# EAGLE design Carte USB (EAGLE 7.2.0)
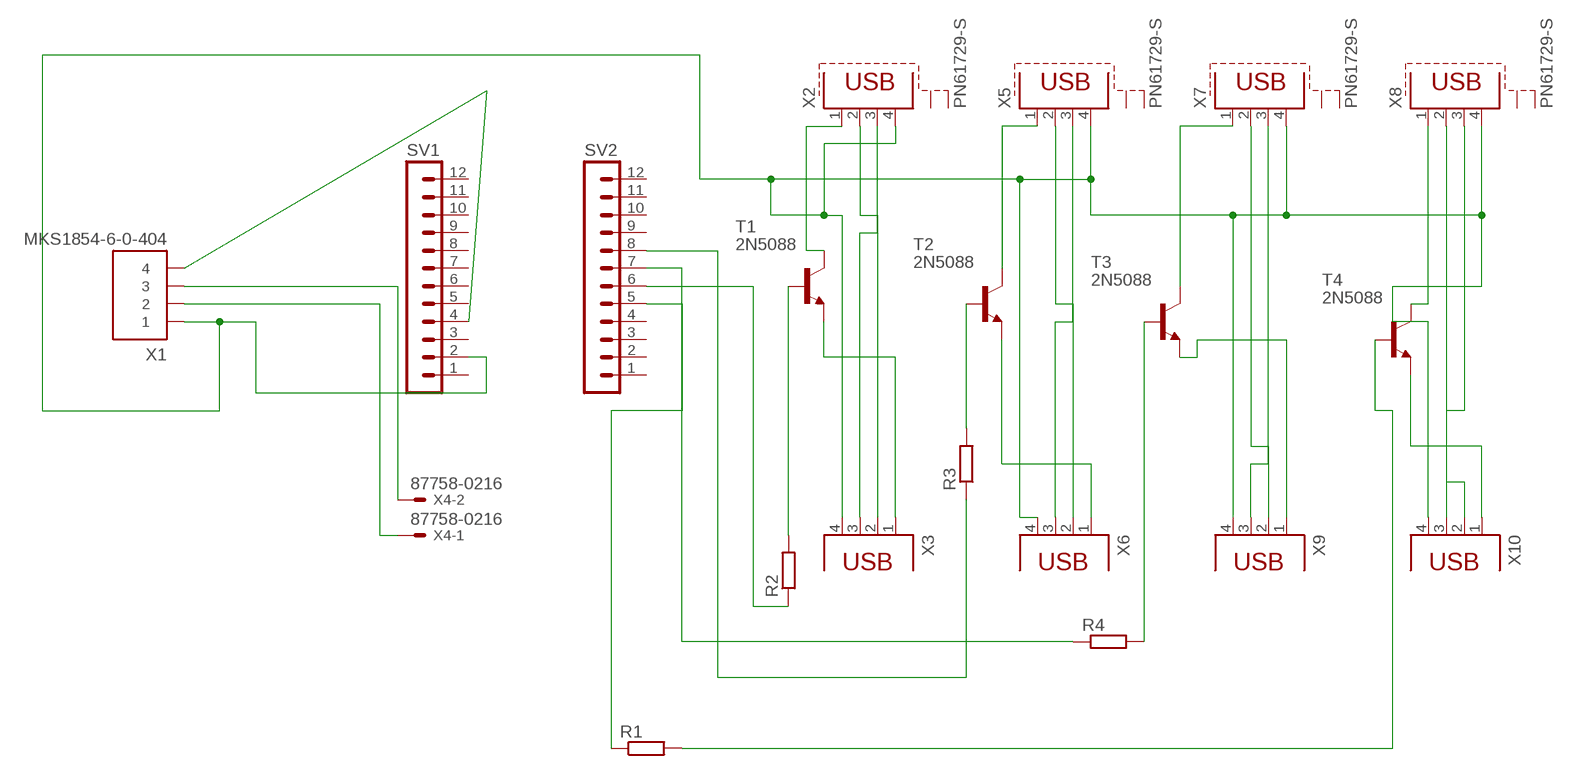
[diagram p0: schematic, sheet 1]

## Parts
R1  R-EU_0207/10  [0207/10]
R2  R-EU_0207/10  [0207/10]
R3  R-EU_0207/10  [0207/10]
R4  R-EU_0207/10  [0207/10]
SV1  MA12-1  [MA12-1]
SV2  MA12-1  [MA12-1]
T1  2N5088  [TO92]
T2  2N5088  [TO92]
T3  2N5088  [TO92]
T4  2N5088  [TO92]
X1  MKS1854-6-0-404  [MKS1854-6-0-404]
X2  PN61729-S  [PN61729-S]
X3  PN87520  [PN87520]
X4  87758-0216  [87758-0216]
X5  PN61729-S  [PN61729-S]
X6  PN87520  [PN87520]
X7  PN61729-S  [PN61729-S]
X8  PN61729-S  [PN61729-S]
X9  PN87520  [PN87520]
X10  PN87520  [PN87520]

## Nets
N$1: X1.3 X4.2
N$2: X1.2 X4.1
N$3: T1.1(C) X2.1
N$4: X2.2 X3.2
N$5: SV1.4 X1.4
N$6: T2.1(C) X5.1
N$7: X2.3 X3.3
N$8: X5.3 X6.3
N$9: T2.3(E) X6.1
N$10: X5.2 X6.2
N$11: T3.1(C) X7.1
N$12: X7.2 X9.2
N$14: X7.3 X9.3
N$15: T4.1(C) X8.1
N$16: X8.2 X10.2
N$17: X8.3 X10.3
N$18: SV1.2 X1.1 X2.4 X3.4 X5.4 X6.4 X7.4 X8.4 X9.4 X10.4
N$20: T3.3(E) X9.1
N$21: T4.3(E) X10.1
N$25: T1.3(E) X3.1
N$26: R3.2 T2.2(B)
N$27: R4.2 T3.2(B)
N$28: R2.2 T1.2(B)
N$29: R1.2 T4.2(B)
N$30: R1.1 SV2.5
N$31: R2.1 SV2.6
N$32: R4.1 SV2.7
N$33: R3.1 SV2.8
Unconnected: SV1.1 SV1.3 SV1.5 SV1.6 SV1.7 SV1.8 SV1.9 SV1.10 SV1.11 SV1.12 SV2.1 SV2.2 SV2.3 SV2.4 SV2.9 SV2.10 SV2.11 SV2.12 X2.S1 X2.S2 X5.S1 X5.S2 X7.S1 X7.S2 X8.S1 X8.S2

## Library data of the parts
R1-R4 = rcl:R-EU_: RESISTOR, European symbol
SV1 SV2 = con-lstb:MA12-1: PIN HEADER; OC_FARNELL: unknown; OC_NEWARK: unknown
T1-T4 = transistor:2N5088: NPN TRANSISTOR
X1 = con-stocko:MKS1854-6-0-404: Serie MKS 1850 Lötstifte In-line, Raster 2.5 mm, Stiftwannen, stehend, mit Rastlasche Source: http://www.stocko.de/de/index.php?seite=ka_rfk2_mks1850.html&rubrik=Katalog+-+RFK+2 rfk_1850.pdf; OC_FARNELL: 1141862; OC_NEWARK: unknown
X2 X5 X7 X8 = con-berg:PN61729-S: BERG USB connector; OC_FARNELL: unknown; OC_NEWARK: unknown
X3 X6 X9 X10 = con-berg:PN87520: BERG USB connector; OC_FARNELL: unknown; OC_NEWARK: unknown
X4 = con-molex:87758-0216: 2 Pin - 2mm Dual Row Single Wafer, Vertical T/H HDR Source: http://www.molex.com/pdm_docs/sd/877580616_sd.pdf; MPN: 87758-0216; OC_FARNELL: unknown; OC_NEWARK: 94M1513

## Net classes
0 default: width 0.75 mm

## Board
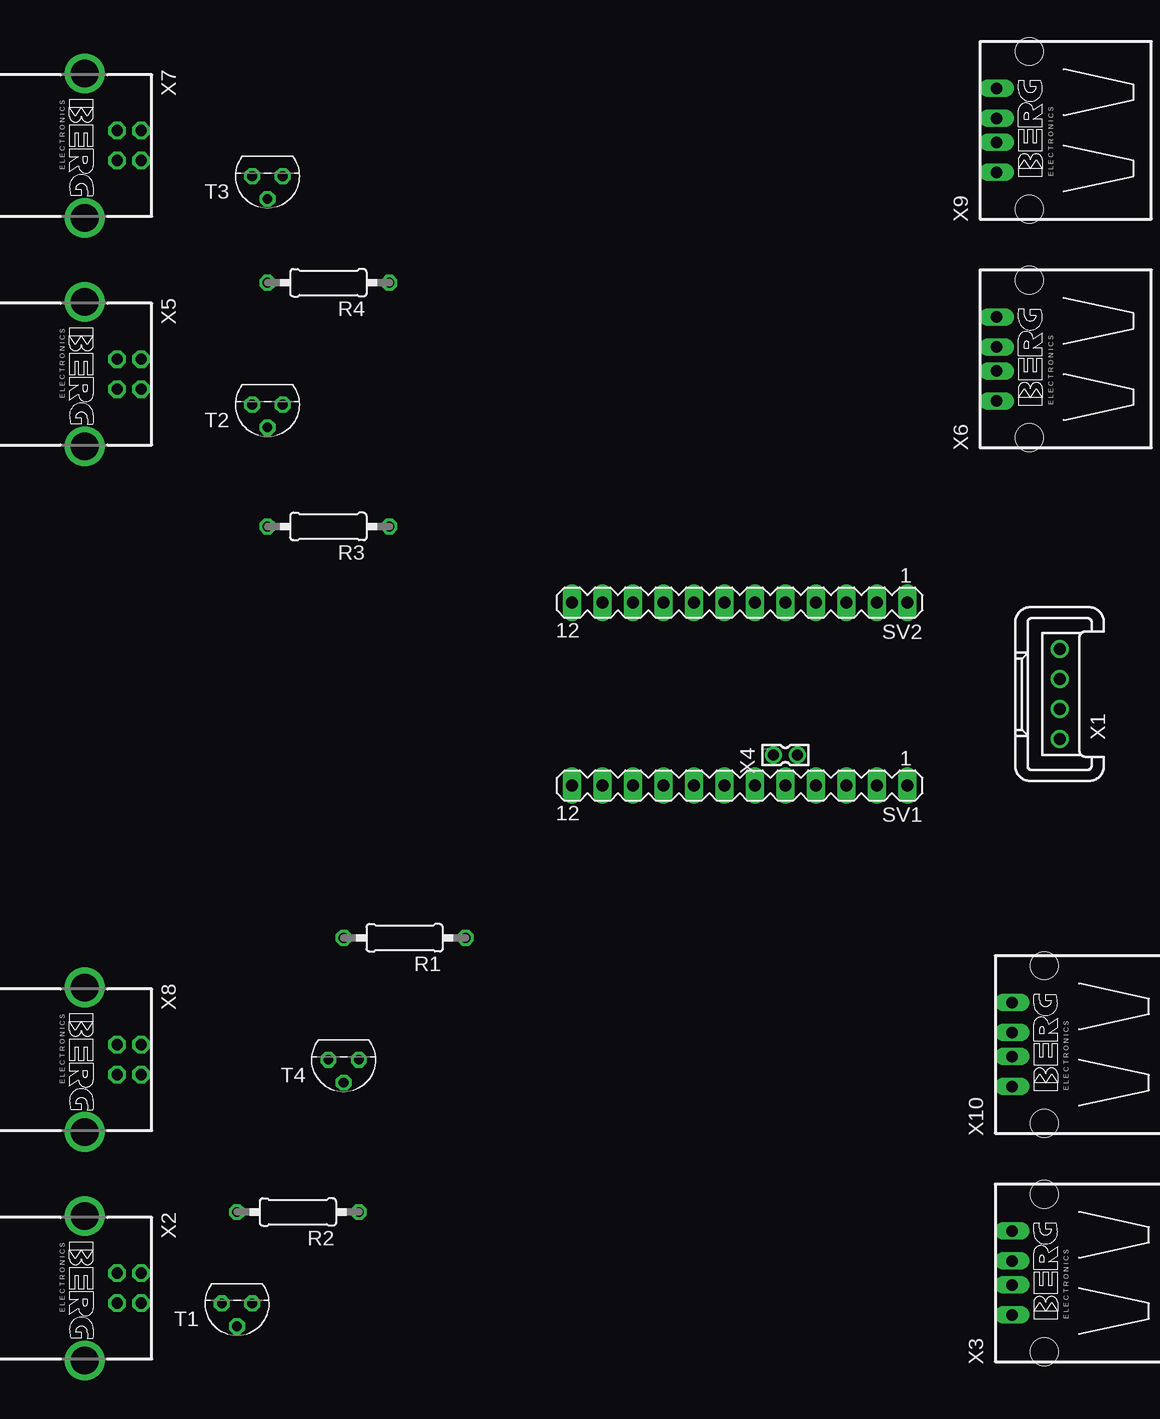
[diagram p1: board, top side]
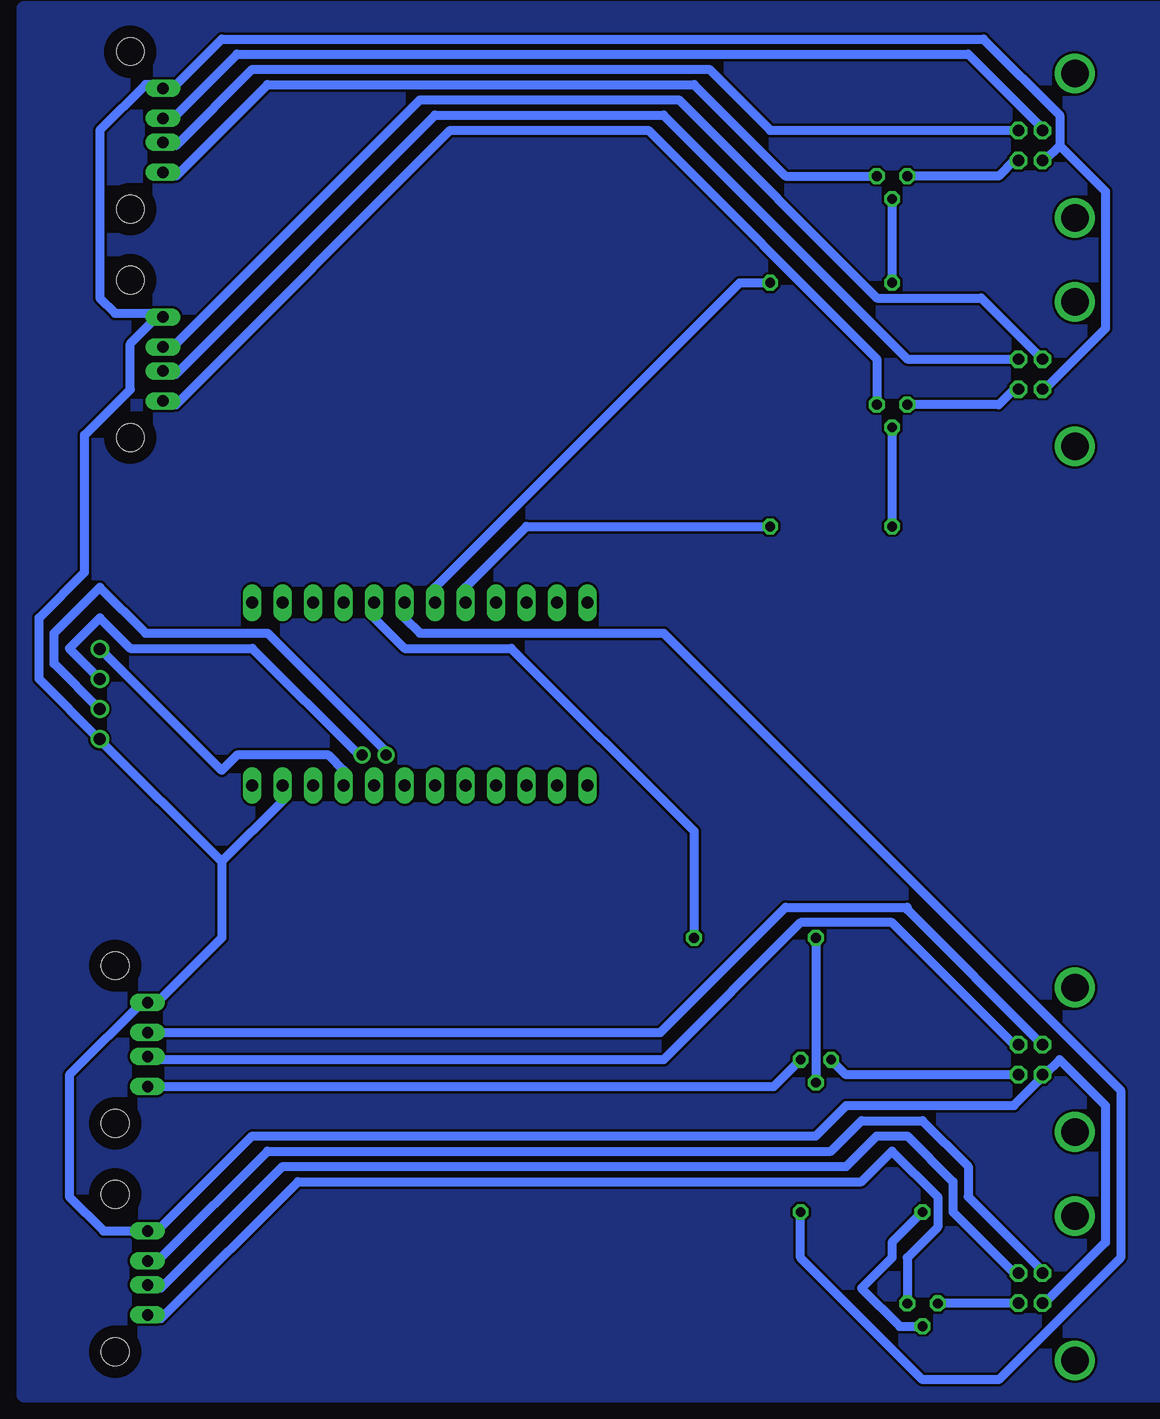
[diagram p2: board, bottom side, seen from below]

No outline drawn. Coordinates in mm, seen from the top.
Copper layers (1*16): Top 0.035mm / dielectric 1.5mm / Bottom 0.035mm
Design rules "default": minimum track width 10mil, minimum drill 24mil, track to track 8mil, track to pad 8mil, pad to pad 8mil, via to via 8mil, smd to smd 8mil, copper to edge 40mil, drill to drill 8mil, minimum pad ring 10mil, minimum via ring 8mil, stop-mask expansion 4mil, vias tented up to drill 0mil, thermal gap 10mil

### Footprints (pad centres in the part's own frame; a part is rotated, then mirrored left to right if it is on the bottom)
0207/10 = drill 0.813 octagon: 1 -5.08,0; 2 5.08,0
MA12-1 = drill 1.016 long: 1 -13.97,0; 2 -11.43,0; 3 -8.89,0; 4 -6.35,0; 5 -3.81,0; 6 -1.27,0; 7 1.27,0; 8 3.81,0; 9 6.35,0; 10 8.89,0; 11 11.43,0; 12 13.97,0
TO92 = drill 0.813 octagon: 1 1.27,0; 2 0,1.905; 3 -1.27,0
MKS1854-6-0-404 = drill 1 pad 1.422: 1 -3.75,0; 2 -1.25,0; 3 1.25,0; 4 3.75,0
PN61729-S = drill 0.95 octagon: 1 1.25,4.71; 2 -1.25,4.71; 3 -1.25,2.71; 4 1.25,2.71 | drill 2.3 pad 2.9: S1 -6.02,0; S2 6.02,0
PN87520 = drill 0.95 long: 1 -3.5,2.71; 2 -1,2.71; 3 1,2.71; 4 3.5,2.71 | hole 2.3: -6.57,0; 6.57,0
87758-0216 = drill 0.9 pad 1.27: 1 0,-1; 2 0,1

### Placement (x,y rotation side)
R1  125.73,35.56 180 top
R2  116.84,12.7 180 top
R3  119.38,69.85 180 top
R4  119.38,90.17 180 top
SV1  153.67,48.26 180 top
SV2  153.67,63.5 180 top
T1  111.76,5.08 180 top
T2  114.3,80.01 180 top
T3  114.3,99.06 180 top
T4  120.65,25.4 180 top
X1  180.34,55.88 90 top
X2  99.06,6.35 270 top
X3  179.07,7.62 90 top
X4  157.48,50.8 270 top
X5  99.06,82.55 270 top
X6  177.8,83.82 90 top
X7  99.06,101.6 270 top
X8  99.06,25.4 270 top
X9  177.8,102.87 90 top
X10  179.07,26.67 90 top

### Tracks (layer width: path | path; a pad name or v marks a point on that pad's centre or on a via)
N$1
  Bottom 0.75: X4.2 158.75,50.8 167.64,59.69 177.8,59.69 180.34,62.23 182.88,59.69 180.34,57.15 X1.3
N$2
  Bottom 0.75: X4.1 156.21,50.8 166.37,60.96 176.53,60.96 180.34,64.77 184.15,60.96 184.15,58.42 180.34,54.61 X1.2
N$3
  Bottom 0.75: T1.1 104.14,5.08 X2.1
N$4
  Bottom 0.75: X2.2 104.14,7.62 109.22,12.7 109.22,15.24 113.03,19.05 115.57,19.05 118.11,16.51 165.1,16.51 175.26,6.35 X3.2
N$5
  Bottom 0.75: SV1.4 160.02,49.53 161.29,50.8 168.91,50.8 170.18,49.53 180.34,59.69 X1.4
N$6
  Bottom 0.75: T2.1 105.41,80.01 104.14,81.28 X5.1
N$7
  Bottom 0.75: X2.3 101.6,7.62 107.95,13.97 107.95,16.51 111.76,20.32 116.84,20.32 119.38,17.78 166.37,17.78 175.26,8.89 X3.3
N$8
  Bottom 0.75: 101.6,83.82 X5.3 106.87,88.9 115.57,88.9 132.08,105.41 153.67,105.41 173.99,85.09 X6.3
N$9
  Bottom 0.75: T2.3 115.57,83.82 134.62,102.87 151.13,102.87 173.99,80.01 X6.1
N$10
  Bottom 0.75: X5.2 104.14,83.82 113.03,83.82 133.35,104.14 152.4,104.14 173.99,82.55 X6.2
N$11
  Bottom 0.75: T3.1 105.41,99.06 104.14,100.33 X7.1
N$12
  Bottom 0.75: X7.2 104.14,102.87 124.46,102.87 129.54,107.95 167.64,107.95 173.99,101.6 X9.2
N$14
  Bottom 0.75: X7.3 101.6,102.87 107.95,109.22 168.91,109.22 173.99,104.14 X9.3
N$15
  Bottom 0.75: X8.1 118.13,24.15 T4.1
N$16
  Bottom 0.75: X10.2 175.26,25.4 133.35,25.4 121.92,36.83 114.3,36.83 104.14,26.67 X8.2
N$17
  Bottom 0.75: 101.6,26.67 X8.3 113.03,37.91 113.03,38.1 123.19,38.1 133.62,27.67 X10.3
N$18
  Bottom 0.75: 100.33,101.6 96.52,97.79 96.52,86.36 101.6,81.28 X5.4 | 100.33,101.6 101.6,100.33 X7.4 | 175.26,87.63 179.07,87.63 180.34,88.9 180.34,102.87 176.53,106.68 175.26,106.68 X9.4 173.99,106.68 170.18,110.49 106.68,110.49 100.33,104.14 100.33,101.6 | 101.6,24.13 100.33,25.4 96.52,21.59 96.52,10.16 101.6,5.08 X2.4 | 176.53,11.43 X3.4 | SV1.2 165.1,46.99 170.18,41.91 | 101.6,24.13 104.14,21.59 118.11,21.59 120.65,19.05 167.64,19.05 175.26,11.43 X3.4 | 101.6,24.13 X8.4 | 175.26,87.63 177.8,85.09 177.8,81.28 181.61,77.47 181.61,66.04 185.42,62.23 185.42,57.15 180.34,52.07 | 175.26,87.63 X6.4 | 180.34,52.07 X1.1 | X3.4 180.03,11.12 182.88,13.97 182.88,24.13 176.53,30.48 X10.4 175.57,30.17 170.18,35.56 170.18,41.91 | 180.34,52.07 170.18,41.91
N$19
  pour Bottom: 91.44,113.03 185.42,113.03 186.69,113.03 186.69,-2.54 91.44,-2.54
N$20
  Bottom 0.75: T3.3 123.19,99.06 130.81,106.68 166.37,106.68 173.99,99.06 X9.1
N$21
  Bottom 0.75: X10.1 124.15,23.17 T4.3
N$25
  Bottom 0.75: T1.3 113.03,8.89 110.49,11.43 110.49,13.97 114.3,17.78 116.84,15.24 163.83,15.24 175.26,3.81 X3.1
N$26
  Bottom 0.75: T2.2 R3.2
N$27
  Bottom 0.75: T3.2 R4.2
N$28
  Bottom 0.75: R2.2 114.3,10.16 114.3,8.89 116.84,6.35 113.67,3.17 T1.2
N$29
  Bottom 0.75: R1.2 T4.2
N$30
  Bottom 0.75: R1.1 130.81,44.45 146.05,59.69 154.94,59.69 157.48,62.23 SV2.5
N$31
  Bottom 0.75: R2.1 121.92,8.89 111.76,-1.27 105.41,-1.27 95.25,8.89 95.25,22.86 133.35,60.96 153.67,60.96 154.94,62.23 SV2.6
N$32
  Bottom 0.75: R4.1 127,90.17 152.4,64.77 SV2.7
N$33
  Bottom 0.75: R3.1 144.78,69.85 149.86,64.77 SV2.8